# EAGLE schematic powerSupplyATmega168LedButton (EAGLE 9.6.2)
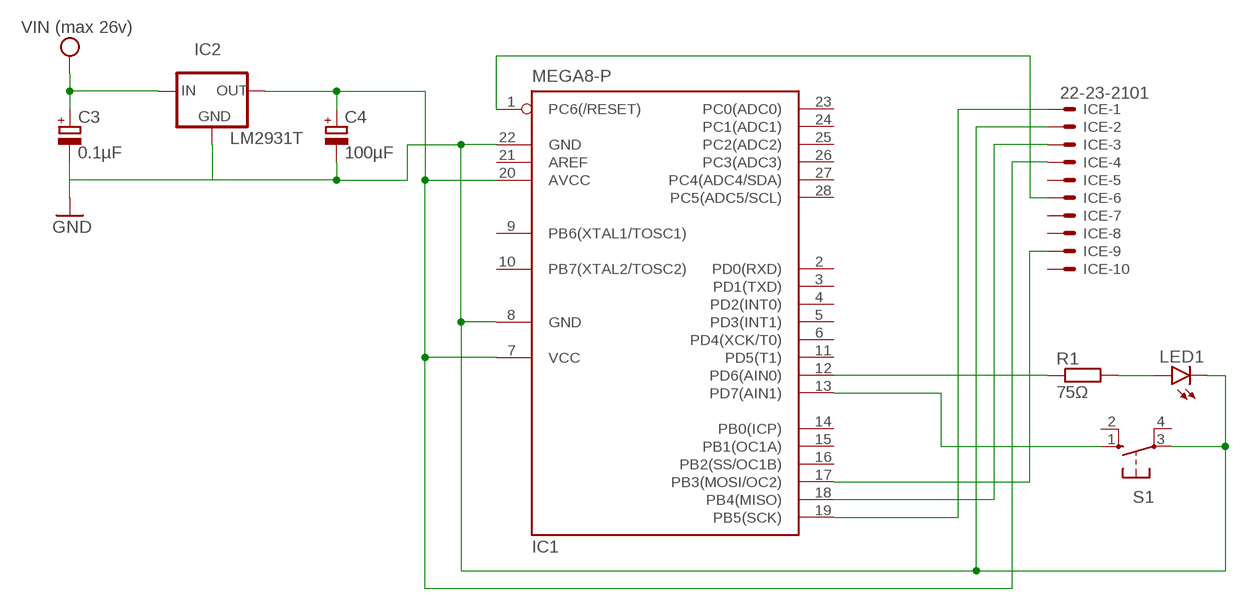
[diagram p0: schematic, sheet 1]

## Parts
C3  0.1µF  CPOL-EUE5-5  [E5-5]
C4  100µF  CPOL-EUE5-5  [E5-5]
IC1  MEGA8-P  [DIL28-3]
IC2  LM2931T  [TO220S]
ICE  22-23-2101  [22-23-2101]
LED1  SFH482  [SFH482]
R1  75Ω  R-EU_0617/17  [0617/17]
S1  10-XX  [B3F-10XX]

## Nets
GND: C3.- C4.- IC1.8(GND) IC1.22(GND) IC2.2(GND) ICE.2 LED1.K(C) S1.3(P)
N$1: LED1.A R1.2
N$2: IC1.19(PB5(SCK)) ICE.1
N$3: IC1.18(PB4(MISO)) ICE.3
N$4: C4.+ IC1.7(VCC) IC1.20(AVCC) IC2.3(OUT) ICE.4
N$5: IC1.1(PC6(/RESET)) ICE.6
N$6: IC1.17(PB3(MOSI/OC2)) ICE.9
N$7: IC1.12(PD6(AIN0)) R1.1
N$8: IC1.13(PD7(AIN1)) S1.1(S)
VCC: C3.+ IC2.1(IN) ; supply symbol labelled VIN (max 26v)
Unconnected: IC1.2(PD0(RXD)) IC1.3(PD1(TXD)) IC1.4(PD2(INT0)) IC1.5(PD3(INT1)) IC1.6(PD4(XCK/T0)) IC1.9(PB6(XTAL1/TOSC1)) IC1.10(PB7(XTAL2/TOSC2)) IC1.11(PD5(T1)) IC1.14(PB0(ICP)) IC1.15(PB1(OC1A)) IC1.16(PB2(SS/OC1B)) IC1.21(AREF) IC1.23(PC0(ADC0)) IC1.24(PC1(ADC1)) IC1.25(PC2(ADC2)) IC1.26(PC3(ADC3)) IC1.27(PC4(ADC4/SDA)) IC1.28(PC5(ADC5/SCL)) ICE.5 ICE.7 ICE.8 ICE.10 S1.2(S1) S1.4(P1)

## Library data of the parts
C3 C4 = rcl:CPOL-EU: POLARIZED CAPACITOR, European symbol; SPICEPREFIX: C
IC1 = atmel:MEGA8-P: MICROCONTROLLER 8 Kbytes FLASH, 1 kbytes SRAM, 512 bytes EEPROM, USART, 4-channel 10 bit ADC, 2-channel 8 bit ADC Pin compatible with Atmega48, ATMega88, ATMega168 Source: avr.lbr; OC_FARNELL: unknown; OC_NEWARK: unknown
IC2 = v-reg-3:LM2931: National Semiconductor <http://www.national.com> Low Dropout Fixed Regulator Vin up to 26V, Reverse Batterie/Load Dump/Short Circuit/Overload Protection,
ICE = con-molex:22-23-2101: .100" (2.54mm) Center Header - 10 Pin; MF: MOLEX; MPN: 22-23-2101; OC_FARNELL: 1756828; OC_NEWARK: 94C0765
LED1 = led:SFH482: IR LED infrared emitting diode, Infineon
R1 = rcl:R-EU_: RESISTOR, European symbol; SPICEPREFIX: R
S1 = switch-omron:10-XX: OMRON SWITCH; MPN: B3F-1000; OC_FARNELL: 176432; OC_NEWARK: 36M3542